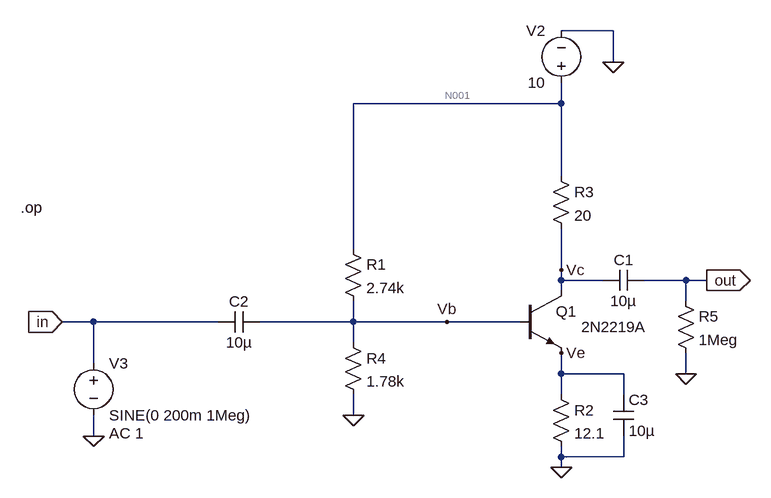
[diagram p0: schematic common_emitter.asc]
common_emitter.asc, the LTspice schematic file:
Version 4
SHEET 1 892 680
WIRE 432 -416 352 -416
WIRE 432 -368 432 -416
WIRE 352 -304 352 -336
WIRE 352 -304 32 -304
WIRE 352 -192 352 -304
WIRE 32 -80 32 -304
WIRE 352 -48 352 -112
WIRE 352 -32 352 -48
WIRE 416 -32 352 -32
WIRE 544 -32 480 -32
WIRE 576 -32 544 -32
WIRE 352 -16 352 -32
WIRE 544 0 544 -32
WIRE -368 32 -416 32
WIRE -176 32 -368 32
WIRE 32 32 32 0
WIRE 32 32 -112 32
WIRE 176 32 32 32
WIRE 288 32 176 32
WIRE 32 64 32 32
WIRE -368 96 -368 32
WIRE 352 112 352 80
WIRE 448 112 352 112
WIRE 544 112 544 80
WIRE 352 144 352 112
WIRE 448 144 448 112
WIRE 32 176 32 144
WIRE -368 208 -368 176
WIRE 352 240 352 224
WIRE 448 240 448 208
WIRE 448 240 352 240
WIRE 352 256 352 240
FLAG -368 208 0
FLAG -416 32 in
IOPIN -416 32 In
FLAG 576 -32 out
IOPIN 576 -32 Out
FLAG 176 32 Vb
FLAG 352 -48 Vc
FLAG 352 80 Ve
FLAG 544 112 0
FLAG 352 256 0
FLAG 32 176 0
FLAG 432 -368 0
SYMBOL res 16 -96 R0
SYMATTR InstName R1
SYMATTR Value 2.74k
SYMBOL npn 288 -16 R0
WINDOW 3 95 56 Left 2
SYMATTR Value 2N2219A
SYMATTR InstName Q1
SYMBOL cap 480 -48 R90
WINDOW 0 0 32 VBottom 2
WINDOW 3 32 32 VTop 2
SYMATTR InstName C1
SYMATTR Value 10µ
SYMBOL cap -112 16 R90
WINDOW 0 0 32 VBottom 2
WINDOW 3 32 32 VTop 2
SYMATTR InstName C2
SYMATTR Value 10µ
SYMBOL voltage -368 80 R0
WINDOW 123 24 124 Left 2
WINDOW 39 0 0 Left 0
SYMATTR Value2 AC 1
SYMATTR InstName V3
SYMATTR Value SINE(0 200m 1Meg)
SYMBOL res 528 -16 R0
SYMATTR InstName R5
SYMATTR Value 1Meg
SYMBOL res 336 128 R0
SYMATTR InstName R2
SYMATTR Value 12.1
SYMBOL cap 432 144 R0
SYMATTR InstName C3
SYMATTR Value 10µ
SYMBOL res 16 48 R0
SYMATTR InstName R4
SYMATTR Value 1.78k
SYMBOL voltage 352 -320 R180
WINDOW 0 24 96 Left 2
WINDOW 3 24 16 Left 2
WINDOW 123 0 0 Left 0
WINDOW 39 0 0 Left 0
SYMATTR InstName V2
SYMATTR Value 10
SYMBOL res 336 -208 R0
SYMATTR InstName R3
SYMATTR Value 20
TEXT -480 -144 Left 2 !.op

The netlist it stands for:
* common_emitter.asc
R1 N001 Vb 2.74k
Q1 Vc Vb Ve 0 2N2219A
C1 out Vc 10µ
C2 Vb in 10µ
V3 in 0 SINE(0 200m 1Meg) AC 1
R5 out 0 1Meg
R2 Ve 0 12.1
C3 Ve 0 10µ
R4 Vb 0 1.78k
V2 N001 0 10
R3 N001 Vc 20
.model NPN NPN
.model PNP PNP
.lib standard.bjt
.op
.backanno
.end

* Results of the author's LTspice run, read from the files saved beside the schematic
* Operating Point:
*   V(n001) = 10 V
*   V(vb) = 2.752 V
*   V(vc) = 6.791 V
*   V(ve) = 1.954 V
*   V(out) = 67.91 pV
*   V(in) = 0 V
*   Ic(Q1) = 160.4 mA
*   Ib(Q1) = 1.099 mA
*   Ie(Q1) = -161.5 mA
*   I(C3) = 0 A
*   I(C2) = 0 A
*   I(C1) = 0 A
*   I(R3) = 160.4 mA
*   I(R4) = 1.546 mA
*   I(R2) = 161.5 mA
*   I(R5) = 0 A
*   I(R1) = 2.645 mA
*   I(V2) = -163.1 mA
*   I(V3) = 0 A
* From the log:
*   Semiconductor Device Operating Points:
*                           --- Bipolar Transistors ---
*   Name:       q1
*   Model:    2n2219a
*   Ib:       1.10e-03
*   Ic:       1.60e-01
*   Vbe:      7.98e-01
*   Vbc:     -4.04e+00
*   Vce:      4.84e+00
*   BetaDC:   1.46e+02
*   Gm:       4.60e+00
*   Rpi:      2.45e+01
*   Rx:       1.00e+01
*   Ro:       4.86e+02
*   Cbe:      2.20e-09
*   Cbc:      3.92e-12
*   Cjs:      0.00e+00
*   BetaAC:   1.13e+02
*   Cbx:      0.00e+00
*   Ft:       3.32e+08